# EAGLE design Shock Clock (EAGLE 9.6.2)
Fall 2021 EE445L This is the baseline schematic
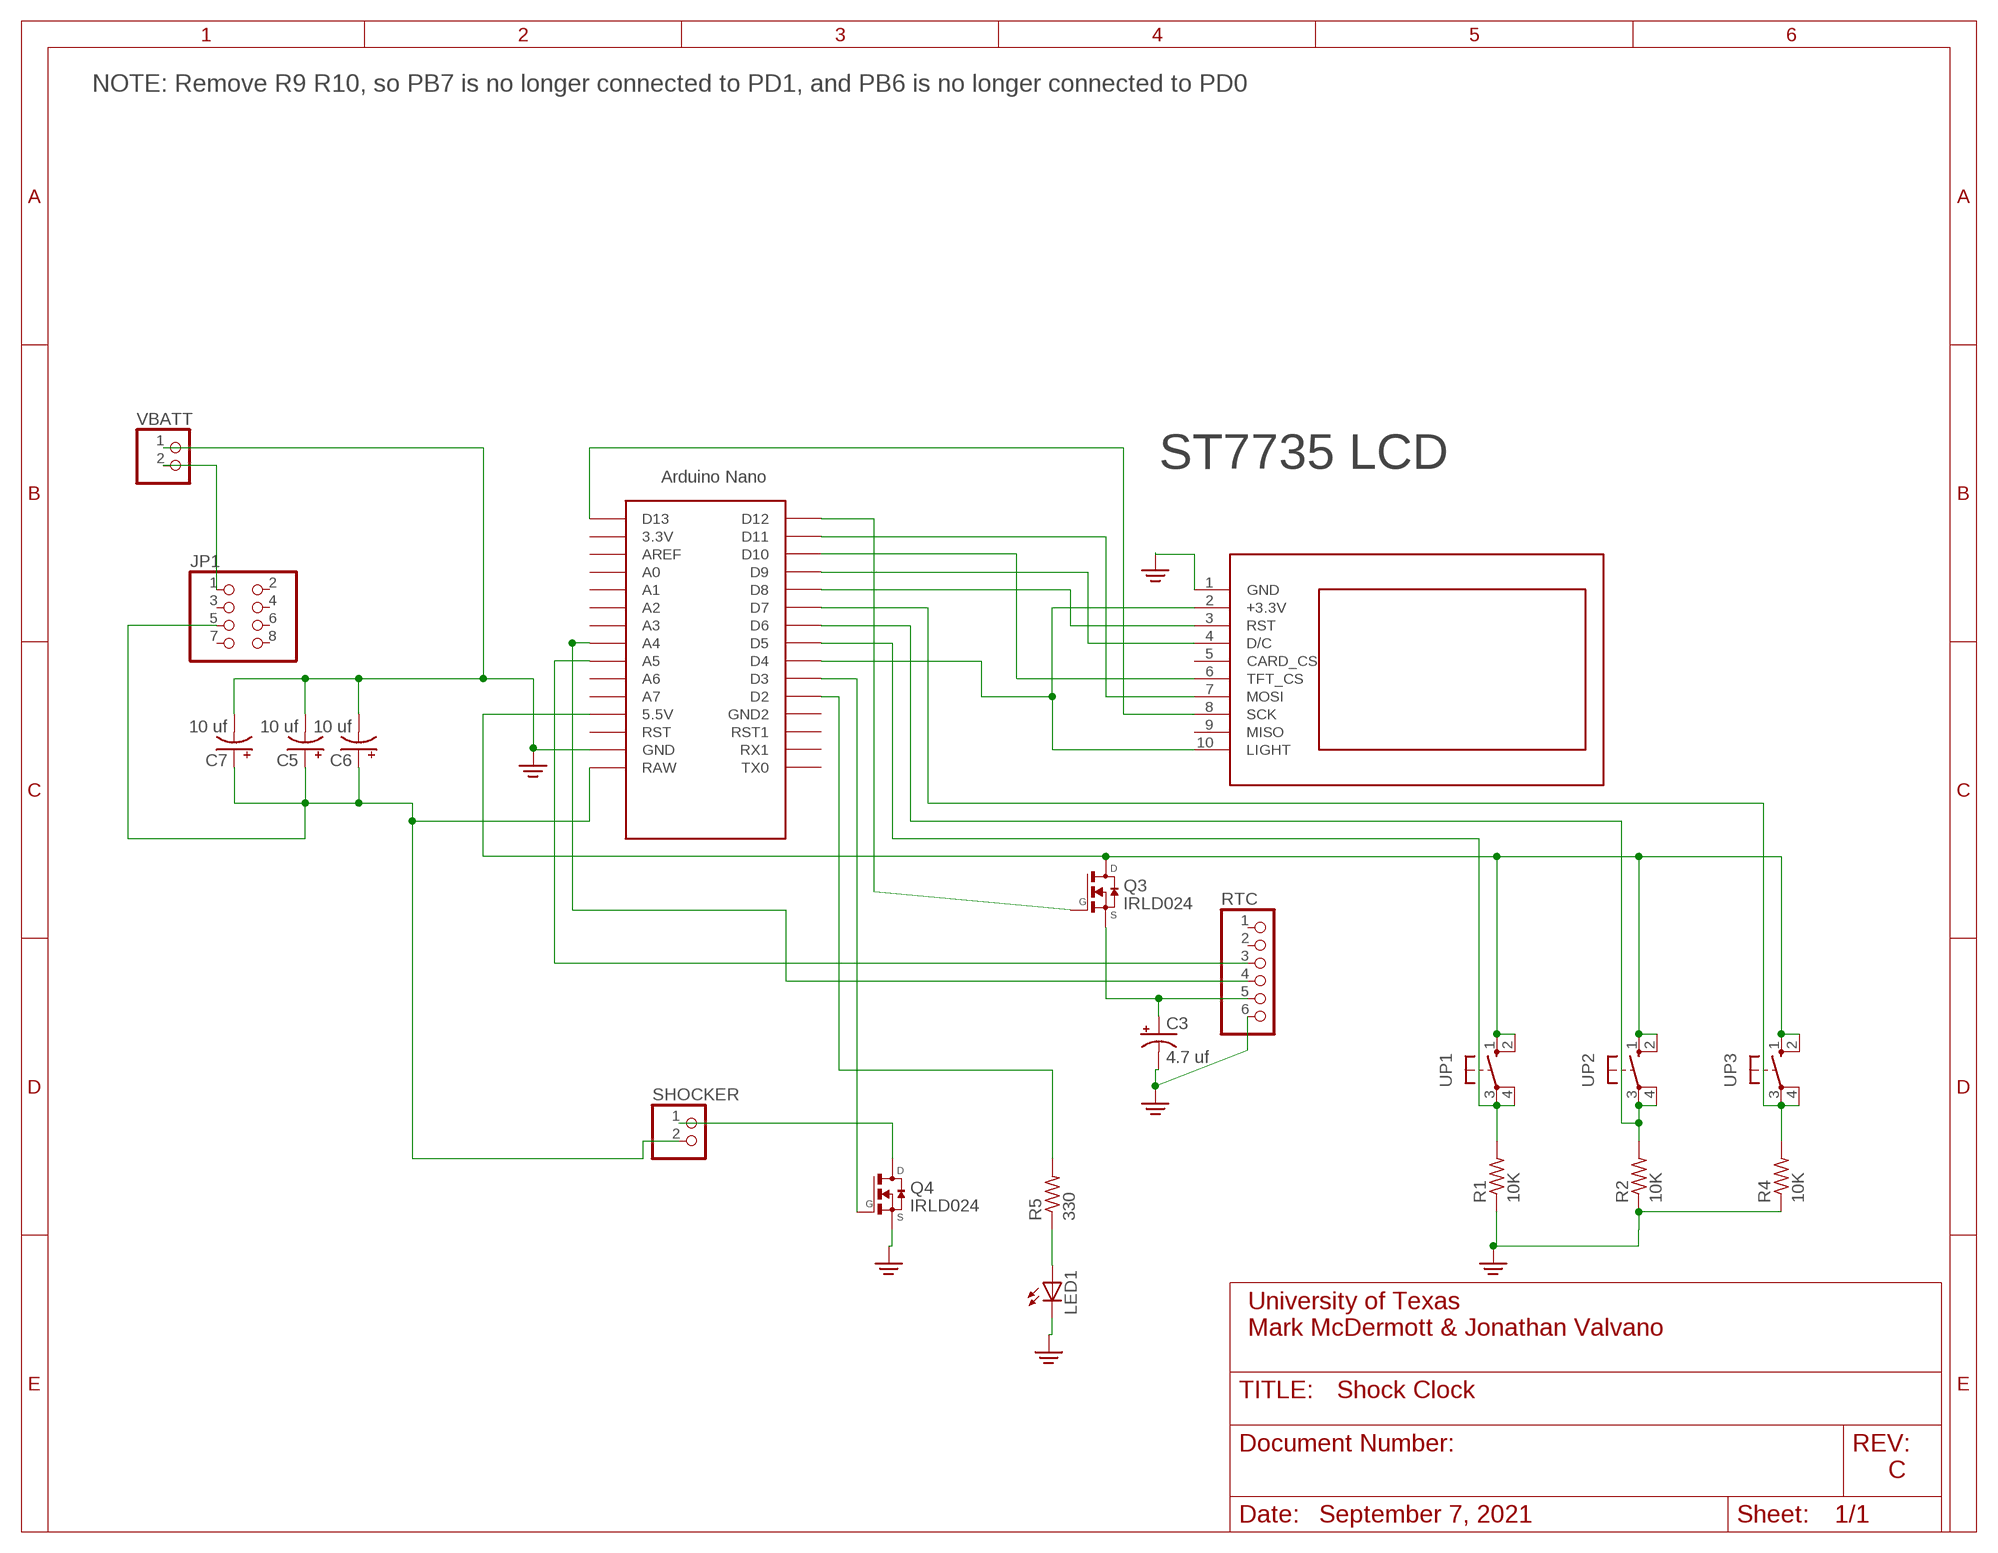
[diagram p0: schematic, sheet 1]

## Parts
C3  4.7 uf  CAPACITOR_POLARIZEDE5-6  [CAP200MILPOLARIZED]
C5  10 uf  CAPACITOR_POLARIZEDE5-6  [CAP200MILPOLARIZED]
C6  10 uf  CAPACITOR_POLARIZEDE5-6  [CAP200MILPOLARIZED]
C7  10 uf  CAPACITOR_POLARIZEDE5-6  [CAP200MILPOLARIZED]
JP1  PINHD-2X4  [2X04]
LED1  LED3MM  [LED3MM]
Q3  IRLD024  [IRLD024]
Q4  IRLD024  [IRLD024]
R1  10K  RESISTOR0204/7  [RES300MIL]
R2  10K  RESISTOR0204/7  [RES300MIL]
R4  10K  RESISTOR0204/7  [RES300MIL]
R5  330  RESISTOR0204/7  [RES300MIL]
RTC  PINHD-1X6  [1X06]
SHOCKER  PINHD-1X2  [1X02]
U$3  ST7735  [ST7735]
U$5  NANO  [NANO]
UP1  B3F-1052  [B3F-10XX]
UP2  B3F-1052  [B3F-10XX]
UP3  B3F-1052  [B3F-10XX]
VBATT  PINHD-1X2  [1X02]

## Nets
5V: Q3.P$1(D) U$5.5V(5.5V) UP1.1(S) UP1.2(S1) UP2.1(S) UP2.2(S1) UP3.1(S) UP3.2(S1)
D2: R5.2 U$5.D2
D3: Q4.P$3(G) U$5.D3
D4: U$3.2(+3.3V) U$3.10(LIGHT) U$5.D4
D5: R1.2 U$5.D5 UP1.3(P) UP1.4(P1)
D6: R2.2 U$5.D6 UP2.3(P) UP2.4(P1)
D7: R4.2 U$5.D7 UP3.3(P) UP3.4(P1)
GND: C3.- C5.- C6.- C7.- LED1.K(C) Q4.P$4(S) R1.1 R2.1 R4.1 RTC.6 U$3.1(GND) U$5.GND VBATT.1
GND4: LED1.A R5.1
N$3: JP1.1 VBATT.2
N$4: U$3.8(SCK) U$5.D13
N$5: U$3.7(MOSI) U$5.D11
N$6: U$3.4(D/C) U$5.D9
N$7: U$3.3(RST) U$5.D8
N$8: U$3.6(TFT_CS) U$5.D10
N$10: RTC.4 U$5.A4
N$11: RTC.3 U$5.A5
N$12: Q3.P$3(G) U$5.D12
N$14: C3.+ Q3.P$4(S) RTC.5
N$16: Q4.P$1(D) SHOCKER.1
VCC: C5.+ C6.+ C7.+ JP1.5 SHOCKER.2 U$5.RAW
Unconnected: JP1.2 JP1.3 JP1.4 JP1.6 JP1.7 JP1.8 RTC.1 RTC.2 U$3.5(CARD_CS) U$3.9(MISO) U$5.3.3V U$5.A0 U$5.A1 U$5.A2 U$5.A3 U$5.A6 U$5.A7 U$5.AREF U$5.GND1(GND2) U$5.ICSP1 U$5.ICSP2 U$5.ICSP3 U$5.ICSP4 U$5.ICSP5 U$5.ICSP6 U$5.RST U$5.RST1 U$5.RX1 U$5.TX0

## Notes on the sheet
- NOTE: Remove R9 R10, so PB7 is no longer connected to PD1, and PB6 is no longer connected to PD0
- ST7735 LCD
- University of Texas
  Mark McDermott & Jonathan Valvano
- C
- September 7, 2021

## Library data of the parts
C3 C5-C7 = EE445L:CAPACITOR_POLARIZED: POLARIZED CAPACITOR, American symbol
JP1 = adafruit:PINHD-2X4: PIN HEADER
LED1 = SparkFun:LED: LEDs Standard schematic elements and footprints for 5mm, 3mm, 1206, and 0603 sized LEDs. 5mm - Spark Fun Electronics SKU : COM-00529 (and others)
Q3 Q4 = EE445L:IRLD024: N-Channel Enhancement MOSFET
R1 R2 R4 R5 = EE445L:RESISTOR: RESISTOR, American symbol
RTC = EE445L:PINHD-1X6: PIN HEADER
SHOCKER VBATT = EE445L:PINHD-1X2: PIN HEADER
U$3 = EE445L:ST7735
U$5 = Arduino-clone:NANO: Arduino Nano
UP1-UP3 = EE445L:B3F-1052: OMRON SWITCH 1.1mm holes; MPN: B3F-1000; OC_FARNELL: 176432; OC_NEWARK: 36M3542

## Board
Fall 2021 EE445L This is the baseline PCB
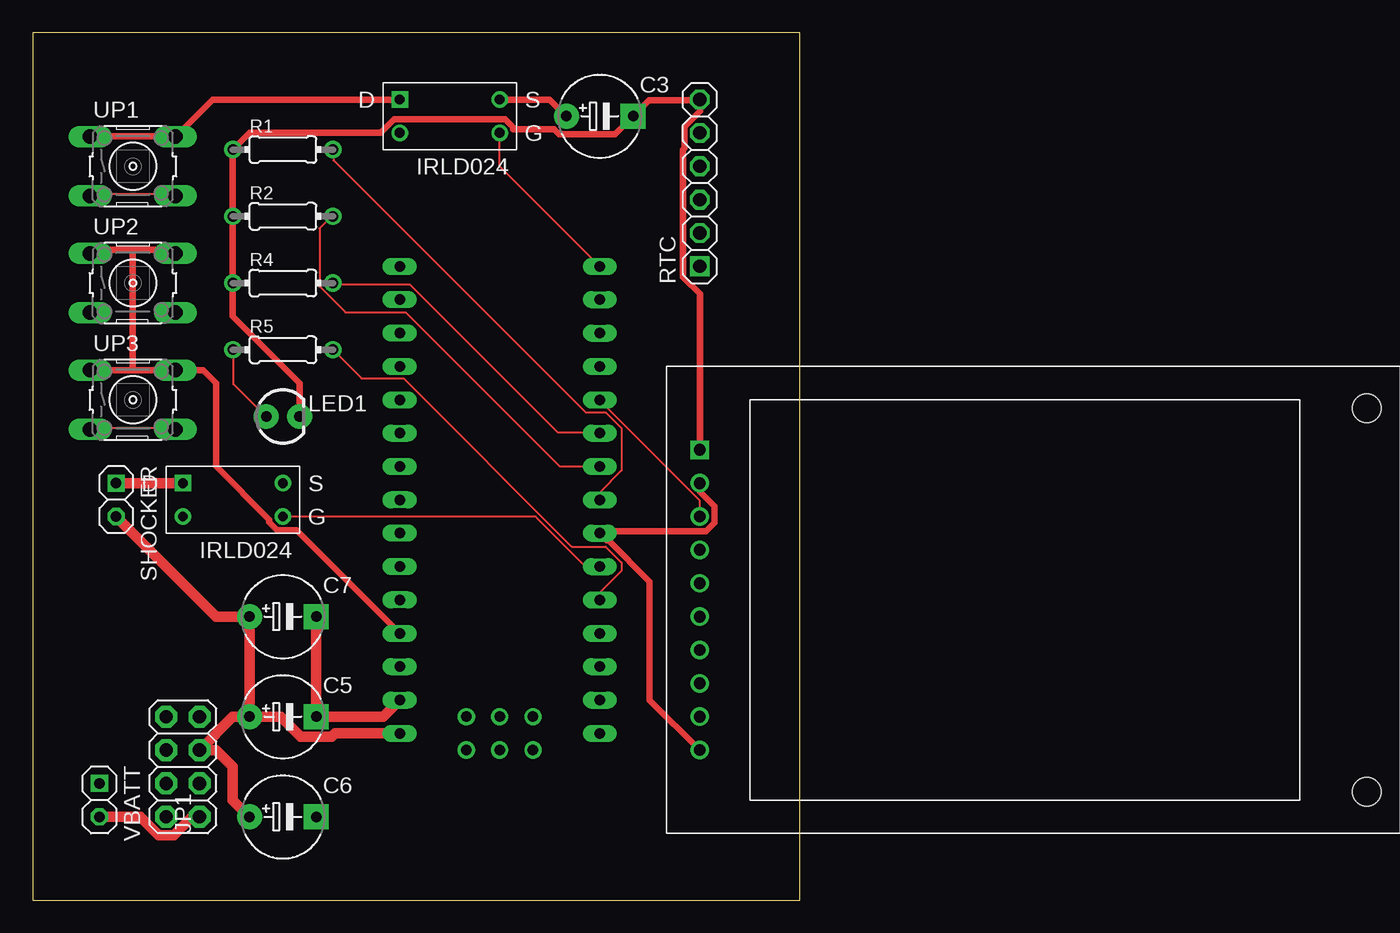
[diagram p1: board, top side]
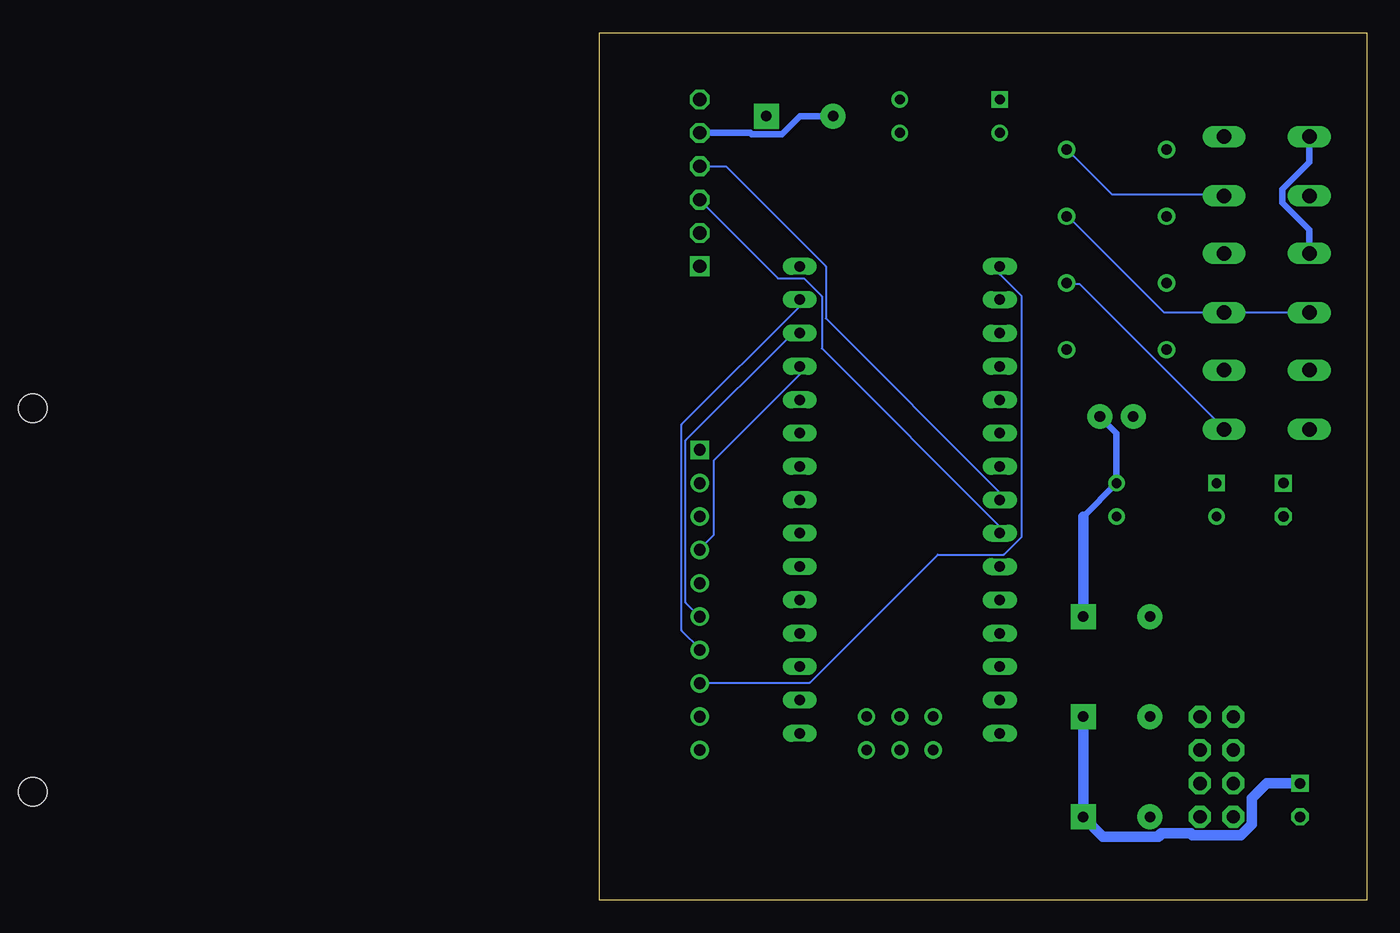
[diagram p2: board, bottom side, seen from below]

Size 58.42 x 66.04 mm. Coordinates in mm from the lower left corner, seen from the top.
Outline: 0,0 58.42,0 58.42,66.04 0,66.04 0,0
Copper layers (1*16): Top 0.035mm / dielectric 1.5mm / Bottom 0.035mm
Design rules "default": minimum track width 6mil, minimum drill 0.35mm, track to track 6mil, track to pad 6mil, pad to pad 6mil, via to via 6mil, smd to smd 6mil, copper to edge 40mil, drill to drill 6mil, minimum pad ring 10mil, minimum via ring 8mil, stop-mask expansion 4mil, vias tented up to drill 0mil, thermal gap 10mil

### Footprints (pad centres in the part's own frame; a part is rotated, then mirrored left to right if it is on the bottom)
CAP200MILPOLARIZED = drill 0.8 pad 1.905: + -2.54,0 | drill 0.8 pad 1.905 square: - 2.54,0
2X04 = drill 1.016 pad 1.676 octagon: 1 -3.81,-1.27; 2 -3.81,1.27; 3 -1.27,-1.27; 4 -1.27,1.27; 5 1.27,-1.27; 6 1.27,1.27; 7 3.81,-1.27; 8 3.81,1.27
LED3MM = drill 0.813 pad 1.88: A -1.27,0; K 1.27,0
IRLD024 = drill 0.75 square: P$1 0,0 | drill 0.75: P$2 0,-2.54; P$3 7.62,-2.54; P$4 7.62,0
RES300MIL = drill 0.8: 1 -3.81,0; 2 3.81,0
1X06 = drill 1 square: 1 -6.35,0 | drill 1 octagon: 2 -3.81,0; 3 -1.27,0; 4 1.27,0; 5 3.81,0; 6 6.35,0
1X02 = drill 0.8 square: 1 -1.27,0 | drill 0.8 octagon: 2 1.27,0
ST7735 = drill 0.9 square: 1 0,0 | drill 0.9: 2 0,-2.54; 3 0,-5.08; 4 0,-7.62; 5 0,-10.16; 6 0,-12.7; 7 0,-15.24; 8 0,-17.78; 9 0,-20.32; 10 0,-22.86 | hole 2.184: 50.8,3.175; 50.8,-26.035
NANO = drill 0.8 long: 3.3V -10.16,24.13; 5V -10.16,-1.27; A0 -10.16,19.05; A1 -10.16,16.51; A2 -10.16,13.97; A3 -10.16,11.43; A4 -10.16,8.89; A5 -10.16,6.35; A6 -10.16,3.81; A7 -10.16,1.27; AREF -10.16,21.59; D2 5.08,1.27; D3 5.08,3.81; D4 5.08,6.35; D5 5.08,8.89; D6 5.08,11.43; D7 5.08,13.97; D8 5.08,16.51; D9 5.08,19.05; D10 5.08,21.59; D11 5.08,24.13; D12 5.08,26.67; D13 -10.16,26.67; GND -10.16,-6.35; GND1 5.08,-1.27; RAW -10.16,-8.89; RST -10.16,-3.81; RST1 5.08,-3.81; RX1 5.08,-6.35; TX0 5.08,-8.89 | drill 0.8: ICSP1 -5.08,-10.16; ICSP2 -5.08,-7.62; ICSP3 -2.54,-10.16; ICSP4 -2.54,-7.62; ICSP5 0,-10.16; ICSP6 0,-7.62
B3F-10XX = drill 1.1 long: 1 -3.251,2.261; 2 3.251,2.261; 3 -3.251,-2.261; 4 3.251,-2.261

### Placement (x,y rotation side)
C3  43.18,59.69 0 top
C5  19.05,13.97 0 top
C6  19.05,6.35 0 top
C7  19.05,21.59 0 top
JP1  11.43,10.16 90 top
LED1  19.05,36.83 0 top
Q3  27.94,60.96 0 top
Q4  11.43,31.75 0 top
R1  19.05,57.15 0 top
R2  19.05,52.07 0 top
R4  19.05,46.99 0 top
R5  19.05,41.91 0 top
RTC  50.8,54.61 90 top
SHOCKER  6.35,30.48 270 top
U$3  50.8,34.29 0 top
U$5  38.1,21.59 0 top
UP1  7.62,55.88 0 top
UP2  7.62,46.99 0 top
UP3  7.62,38.1 0 top
VBATT  5.08,7.62 270 top

### Tracks (layer width: path | path; a pad name or v marks a point on that pad's centre or on a via)
5V
  Top 0.152: 10.87,58.17 UP1.2
  Top 0.508: U$5.5V 20.09,28.18 18.62,28.18 18.02,28.78 18.02,28.98 13.97,33.02 13.97,39.37 12.98,40.36 UP3.2 7.62,40.36 | UP3.1 7.62,40.36 | 7.62,40.36 7.62,49.53 | 7.62,49.53 10.59,49.53 UP2.2 | UP2.1 4.65,49.53 7.62,49.53 | UP1.1 4.39,58.17 10.87,58.17 | UP1.2 13.69,60.96 Q3.P$1
  Bottom 0.508: UP2.1 4.37,51.05 6.42,53.11 6.42,54.13 4.37,56.19 UP1.1
D2
  Top 0.152: U$5.D2 43.18,23.42 44.86,25.09 44.86,25.7 43.64,26.92 41.05,26.92 28.25,39.73 25.04,39.73 R5.2
D3
  Top 0.152: Q4.P$3 38.3,29.21 42.11,25.4 U$5.D3
D4
  Top 0.508: U$3.2 50.8,31.11 51.91,30 51.91,28.75 51.26,28.1 43.34,28.1 U$5.D4 43.71,27.41 43.84,27.41 46.99,24.25 46.99,15.24 U$3.10
D5
  Top 0.152: UP1.3 4.47,53.75 10.87,53.75 UP1.4 | U$5.D5 43.18,31.04 44.86,32.72 44.86,35.92 43.64,37.13 42.11,37.13 22.91,56.34 22.91,57.1 R1.2
  Bottom 0.152: UP1.4 10.87,53.75 19.41,53.75 22.76,57.1 R1.2
D6
  Top 0.152: U$5.D6 40.13,33.02 28.4,44.76 23.82,44.76 21.84,46.74 21.84,51.16 22.76,52.07 R2.2
  Bottom 0.152: 10.87,44.76 4.47,44.76 UP2.3 | 10.87,44.76 15.44,44.76 22.76,52.07 R2.2 | 10.87,44.76 UP2.4
D7
  Top 0.152: U$5.D7 43.18,35.61 39.98,35.61 28.7,46.89 22.91,46.89 R4.2 | UP3.3 4.47,35.92 10.87,35.92 UP3.4
  Bottom 0.152: R4.2 22.76,46.89 21.84,46.89 10.87,35.92 UP3.4
GND
  Top 0.152: 50.8,60.91 RTC.6
  Top 0.508: LED1.K 20.32,39.37 15.24,44.45 R4.1 R2.1 R1.1 16.51,58.42 26.48,58.42 27.51,59.45 35.99,59.45 36.59,58.85 36.59,58.7 39.7,58.7 40.08,58.33 44.36,58.33 C3.- 46.94,60.91 50.8,60.91 | RTC.6 50.8,60.06 49.64,58.9 49.64,57.26 49.53,57.15 49.53,47.45 50.8,46.18 U$3.1
  Top 0.813: U$5.GND 26.67,13.97 C5.- C7.-
  Bottom 0.508: 21.59,29.21 Q4.P$4 19.05,35.56 LED1.K
  Bottom 0.813: VBATT.1 7.62,8.89 8.76,7.75 8.76,5.77 9.58,4.95 13.28,4.95 13.41,5.08 15.64,5.08 15.88,4.84 20.08,4.84 C6.- C5.- | C7.- 21.59,29.21
GND4
  Top 0.152: R5.1 15.29,41.86 15.29,39.27 17.73,36.83 LED1.A
N$3
  Top 0.813: VBATT.2 8.18,6.35 9.58,4.95 10.74,4.95 12.14,6.35 JP1.1
N$4
  Bottom 0.152: U$5.D13 27.94,47.65 26.26,45.97 26.26,27.69 27.64,26.31 32.66,26.31 42.42,16.56 50.8,16.56 U$3.8
N$5
  Bottom 0.152: U$5.D11 43.18,45.21 52.17,36.22 52.17,20.52 50.8,19.15 U$3.7
N$6
  Bottom 0.152: U$5.D9 43.18,40.03 49.73,33.48 49.73,27.84 50.8,26.77 U$3.4
N$7
  Top 0.152: U$3.3 50.8,30.43 43.18,38.05 U$5.D8
N$8
  Bottom 0.152: U$3.6 51.87,22.66 51.87,35 43.79,43.08 43.18,43.08 U$5.D10
N$10
  Bottom 0.152: U$5.A4 27.94,31.04 41.2,44.3 41.2,48.26 48.82,55.88 RTC.4
N$11
  Bottom 0.152: U$5.A5 27.94,28.45 41.5,42.01 41.5,45.97 42.88,47.35 44.86,47.35 50.8,53.29 RTC.3
N$12
  Top 0.152: Q3.P$3 35.56,55.88 U$5.D12
N$14
  Top 0.508: Q3.P$4 39.37,60.96 C3.+
  Bottom 0.508: C3.+ 43.18,59.69 44.54,58.33 46.84,58.33 46.93,58.42 RTC.5
N$16
  Top 0.813: SHOCKER.1 Q4.P$1
VCC
  Top 0.813: C6.+ 15.24,7.62 15.24,10.16 13.97,11.43 JP1.5 15.24,13.97 C5.+ | C5.+ 18.89,13.97 20.41,12.46 22.77,12.46 23.02,12.7 U$5.RAW | C5.+ C7.+ 13.97,21.59 SHOCKER.2